# EAGLE design PM667x_OCXO (EAGLE 7.2.0)
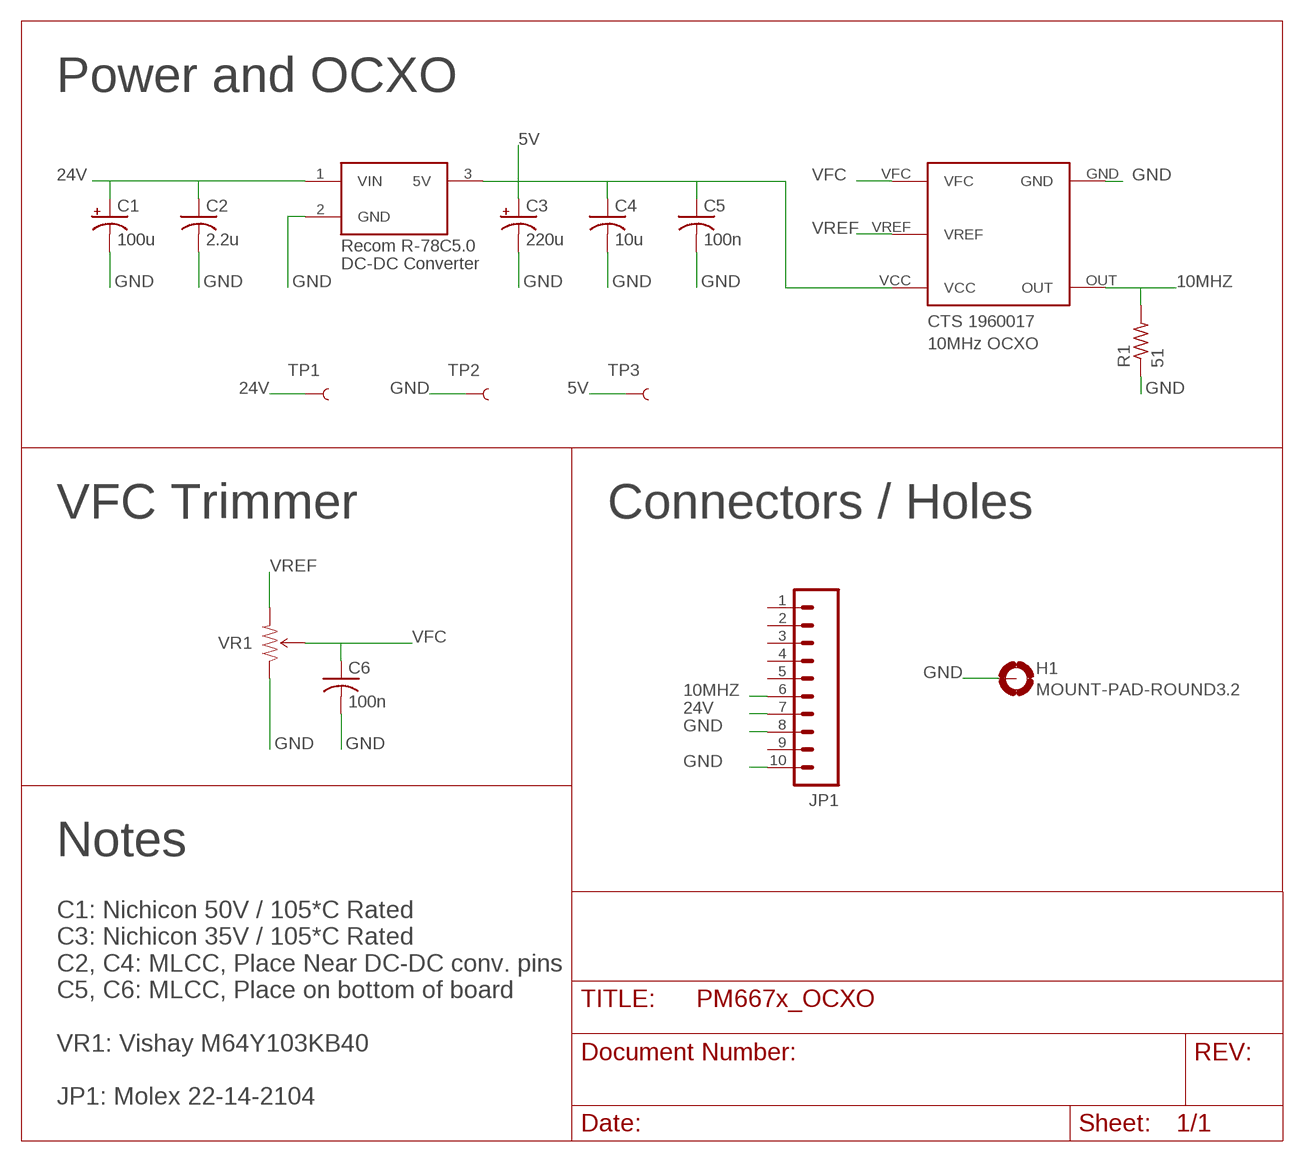
[diagram p0: schematic, sheet 1]

## Parts
C1  100u  CPOL-USE3.5-8  [E3,5-8]
C2  2.2u  C-USC0805  [C0805]
C3  220u  CPOL-USE3.5-8  [E3,5-8]
C4  10u  C-USC0805  [C0805]
C5  100n  C-USC0603  [C0603]
C6  100n  C-USC0603  [C0603]
H1  MOUNT-PAD-ROUND3.2  [3,2-PAD]
JP1  M10NO_SILK_PTH_FEMALE  [1X10_NO_SILK]
R1  51  R-US_R1206  [R1206]
TP1  TEST-POINT3X5  [PAD.03X.05]
TP2  TEST-POINT3X5  [PAD.03X.05]
TP3  TEST-POINT3X5  [PAD.03X.05]
U$1  CTS1960017  [CTS1960017]
U$3  R-78C5.0  [R-78C5.0]
U$4  TE_CB10_TRIMMER  [TE_CONNECTIVITY_CB10_TRIMMER]

## Nets
5V: C3.+ C4.1 C5.1 TP3.P$1 U$1.VCC U$3.3(5V)
10MHZ: JP1.6 R1.2 U$1.OUT
24V: C1.+ C2.1 JP1.7 TP1.P$1 U$3.1(VIN)
GND: C1.- C2.2 C3.- C4.2 C5.2 C6.2 H1.B3,2(MOUNT) JP1.8 JP1.10 R1.1 TP2.P$1 U$1.GND U$3.2(GND) U$4.A(CCW)
VFC: C6.1 U$1.VFC U$4.B(WIPER)
VREF: U$1.VREF U$4.C(CW)
Unconnected: JP1.1 JP1.2 JP1.3 JP1.4 JP1.5 JP1.9

## Notes on the sheet
- Power and OCXO
- Recom R-78C5.0
- DC-DC Converter
- CTS 1960017
- 10MHz OCXO
- VFC Trimmer | Connectors / Holes
- VR1
- Notes
- C1: Nichicon 50V / 105*C Rated
  C3: Nichicon 35V / 105*C Rated
  C2, C4: MLCC, Place Near DC-DC conv. pins
  C5, C6: MLCC, Place on bottom of board
  
  VR1: Vishay M64Y103KB40
  
  JP1: Molex 22-14-2104

## Library data of the parts
C1 C3 = adafruit:CPOL-US: POLARIZED CAPACITOR, American symbol
C2 C4-C6 = adafruit:C-US: CAPACITOR, American symbol
H1 = holes:MOUNT-PAD-ROUND: MOUNTING PAD, round
JP1 = SparkFun-Connectors:M10: Header 10 Standard 10-pin 0.1" header. Use with straight break away headers (SKU : PRT-00116), right angle break away headers (PRT-00553), swiss pins (PRT-00743), machine pins (PRT-00117), and female headers (PRT-00115).; PROD_ID: CONN-11563
R1 = adafruit:R-US_: RESISTOR, American symbol
TP1-TP3 = SparkFun-Passives:TEST-POINT: Bare copper test points for troubleshooting or ICT
U$1 = _CustomParts:CTS1960017
U$3 = _CustomParts:R-78C5.0
U$4 = Ava:TE_CB10_TRIMMER

## Board
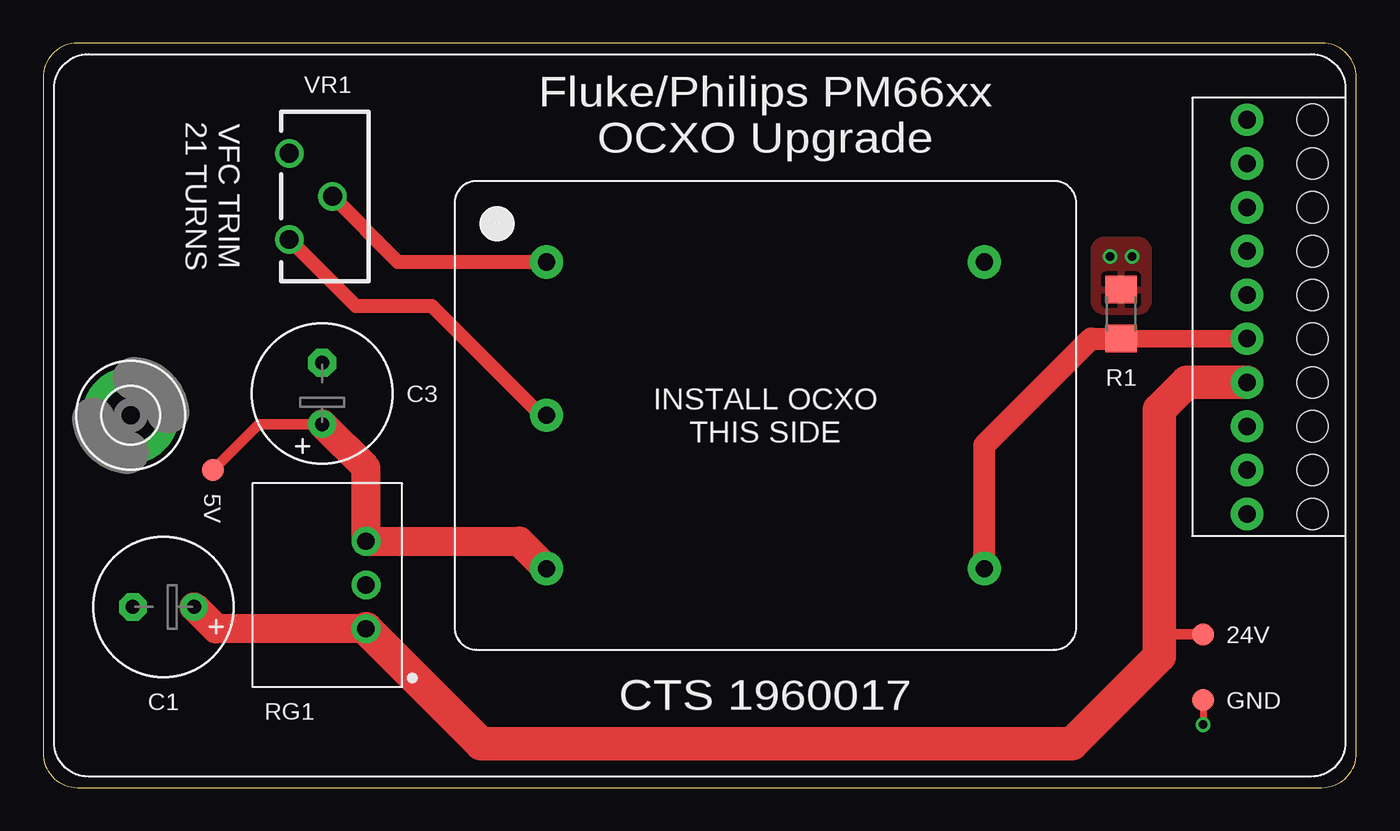
[diagram p1: board, top side]
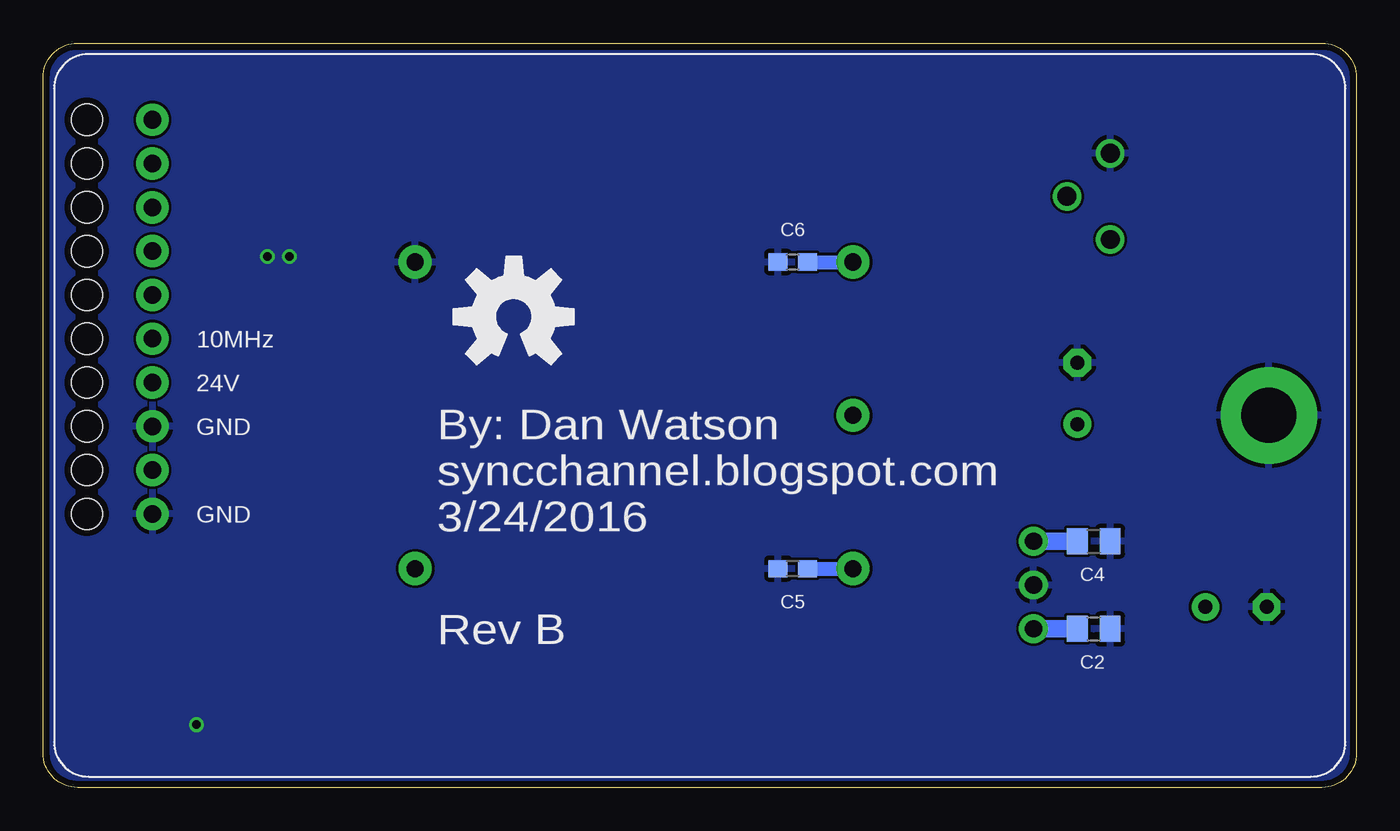
[diagram p2: board, bottom side, seen from below]

Size 76.2 x 43.18 mm. Coordinates in mm from the lower left corner, seen from the top.
Outline: 0,41.18 0,2 arc90 2,0 74.2,0 arc90 76.2,2 76.2,41.18 arc90 74.2,43.18 2,43.18 arc90 0,41.18
Copper layers (1*16): Top 0.0356mm / dielectric 1.5011mm / Bottom 0.0356mm
Design rules "oshpark-2layer *": minimum track width 6mil, minimum drill 13mil, track to track 6mil, track to pad 6mil, pad to pad 6mil, via to via 6mil, smd to smd 6mil, copper to edge 15mil, drill to drill 6mil, minimum pad ring 7mil, minimum via ring 7mil, stop-mask expansion 4mil, vias tented up to drill 20mil, thermal gap 10mil
Holes 1.8 mm at 73.66,38.73 73.66,36.2 73.66,33.66 73.66,31.11 73.66,28.57 73.66,26.04 73.66,23.5 73.66,20.95 73.66,18.41 73.66,15.88

### Footprints (pad centres in the part's own frame; a part is rotated, then mirrored left to right if it is on the bottom)
E3,5-8 = drill 0.813 pad 1.6: + -1.778,0 | drill 0.813 pad 1.6 octagon: - 1.778,0
C0805 = smd 1.2 x 1.5: 1 -0.95,0; 2 0.95,0
C0603 = smd 1.1 x 1: 1 -0.85,0; 2 0.85,0
3,2-PAD = drill 3.2 pad 5.6: B3,2 0,0
1X10_NO_SILK = drill 1.016 pad 1.88: 1 0,0; 2 2.54,0; 3 5.08,0; 4 7.62,0; 5 10.16,0; 6 12.7,0; 7 15.24,0; 8 17.78,0; 9 20.32,0; 10 22.86,0
R1206 = smd 1.6 x 1.803: 1 -1.422,0; 2 1.422,0
PAD.03X.05 = smd 1.27 x 1.27: P$1 0,0
CTS1960017 = drill 1 pad 1.93: GND -8.89,12.7; OUT 8.89,12.7; VCC 8.89,-12.7; VFC -8.89,-12.7; VREF 0,-12.7
R-78C5.0 = drill 1 pad 1.676: 1 -2.54,0; 2 0,0; 3 2.54,0
TE_CONNECTIVITY_CB10_TRIMMER = drill 1.1: A -2.5,0; B 0,2.5; C 2.5,0

### Placement (x,y rotation side)
C1  6.99,10.48 180 top
C2  15.24,9.21 0 bottom
C3  16.19,22.86 90 top
C4  15.24,14.29 0 bottom
C5  32.7,12.7 180 bottom
C6  32.7,30.48 180 bottom
H1  5.08,21.59 0 top
JP1  69.85,38.73 270 top
R1  62.55,27.46 270 top
TP1  67.31,8.89 0 top
TP2  67.31,5.08 0 top
TP3  9.84,18.41 0 top
U$1  41.91,21.59 270 top
U$2  [OSHW-LOGO-L]  48.9,27.3 0 bottom
U$3  18.73,11.75 90 top
U$4  14.29,34.29 270 top

### Tracks (layer width: path | path; a pad name or v marks a point on that pad's centre or on a via)
5V
  Top 0.61: TP3.P$1 12.51,21.08 C3.+
  Top 1.016: 29.11,12.6 U$1.VCC
  Top 1.676: C3.+ 18.73,18.54 U$3.3 27.62,14.29 U$1.VCC
  Bottom 0.813: C5.1 U$1.VCC
  Bottom 1.016: C4.1 U$3.3
10MHZ
  Top 1.016: R1.2 JP1.6
  Top 1.27: U$1.OUT 54.61,19.84 60.8,26.04 R1.2
24V
  Top 0.61: TP1.P$1 64.77,8.89
  Top 1.676: U$3.1 10.03,9.21 C1.+
  Top 1.93: JP1.7 66.36,23.5 64.77,21.91 64.77,8.89 64.77,7.62 59.69,2.54 25.4,2.54 U$3.1
  Bottom 1.016: C2.1 U$3.1
GND  (via drill 0.5)
  Top 0.406: TP2.P$1 v67.31,3.65
  other vias: 61.91,30.8 63.18,30.8
  pour Bottom: -5.08,46.99 -5.08,-5.08 81.28,-5.08 81.28,46.99
  pour Top: 63.5,31.75 61.59,31.75 arc90 60.96,31.11 60.96,28.26 arc90 61.59,27.62 63.5,27.62 arc90 64.14,28.26 64.14,31.11 arc90
VFC
  Top 0.813: U$1.VFC 20.6,30.48 U$4.B
  Bottom 0.813: C6.1 U$1.VFC
VREF
  Top 0.813: U$4.C 18.14,27.94 22.54,27.94 28.89,21.59
  Top 1.016: 28.89,21.59 U$1.VREF

### Text on the board
tNames: VR1 | Fluke/Philips PM66xx / OCXO Upgrade | VFC TRIM / 21 TURNS | R1 | C3 | INSTALL OCXO / THIS SIDE | 5V | 24V | C1 | CTS 1960017 | GND | RG1
bNames: C6 | 10MHz | 24V | GND | By: Dan Watson / syncchannel.blogspot.com / 3/24/2016 | GND | C4 | C5 | Rev B | C2